# Altium project Template_W2022.PrjPcb
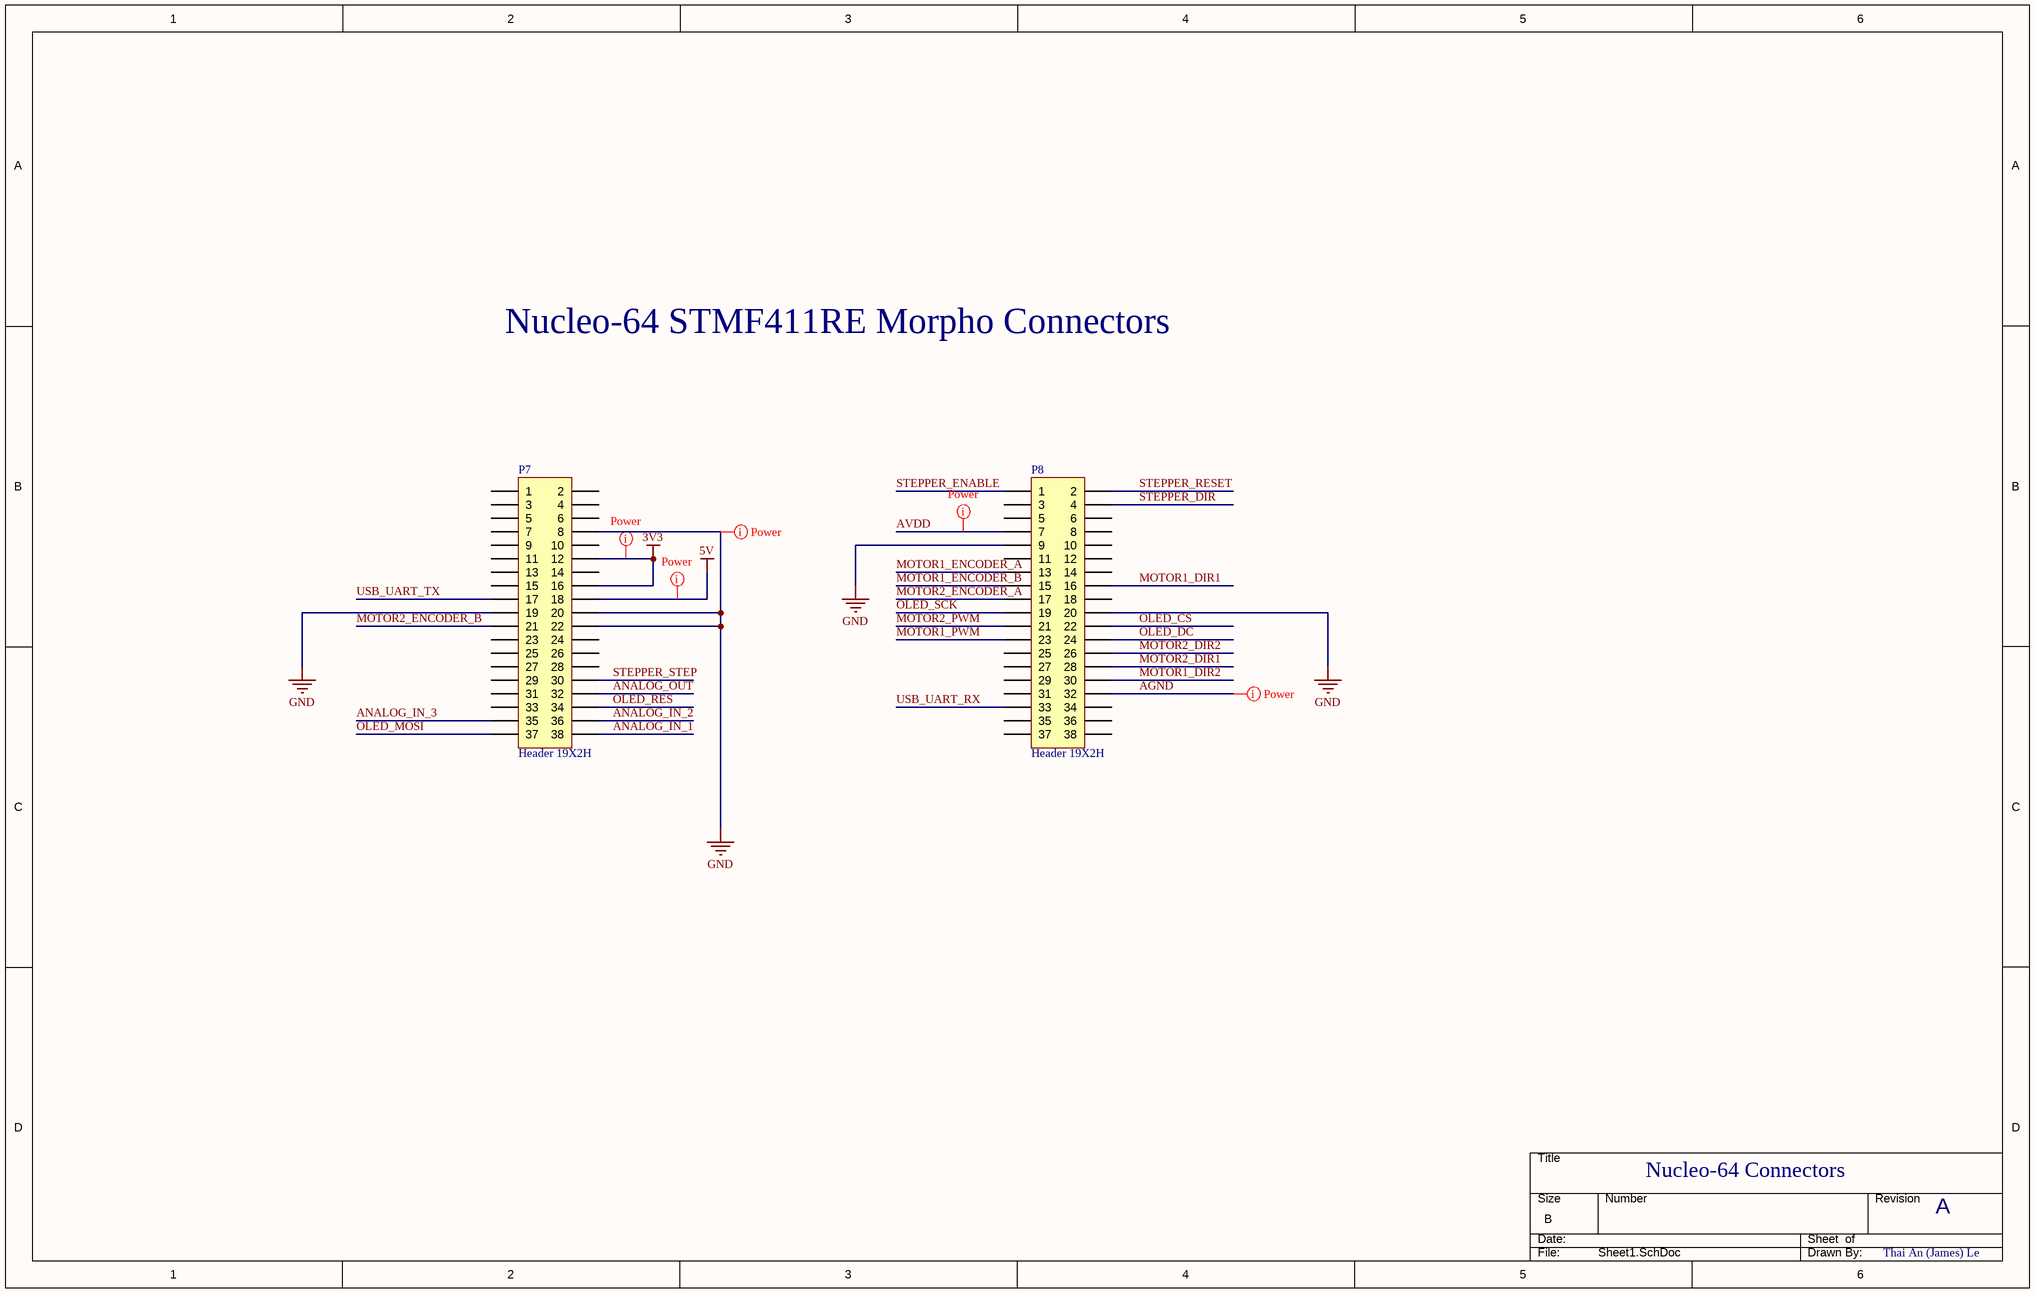
[diagram p0: Sheet1.SchDoc]
4 sheets, 35 parts. Net scope: global (net labels, ports and power ports of the same name join across sheets).
Board file: Template_F411.PcbDoc
Sheets:
  Sheet1.SchDoc
  Sheet2.SchDoc
  Sheet3.SchDoc
  Mechanical.SchDoc

## Sheet Sheet1.SchDoc: Nucleo-64 Connectors
size B; Revision: A

### Parts
P7  Header 19X2H  [PPPC192LFBN-RC]
P8  Header 19X2H  [PPPC192LFBN-RC]

### Nets
3V3: P7.12 P7.16
5V: P7.18
GND: P7.8 P7.19 P7.20 P7.22 P8.9 P8.20
AGND: P8.32
ANALOG_IN_1: P7.38
ANALOG_IN_2: P7.36
ANALOG_IN_3: P7.35
ANALOG_OUT: P7.32
AVDD: P8.7
MOTOR1_DIR1: P8.16
MOTOR1_DIR2: P8.30
MOTOR1_ENCODER_A: P8.13
MOTOR1_ENCODER_B: P8.15
MOTOR1_PWM: P8.23
MOTOR2_DIR1: P8.28
MOTOR2_DIR2: P8.26
MOTOR2_ENCODER_A: P8.17
MOTOR2_ENCODER_B: P7.21
MOTOR2_PWM: P8.21
OLED_CS: P8.22
OLED_DC: P8.24
OLED_MOSI: P7.37
OLED_RES: P7.34
OLED_SCK: P8.19
STEPPER_DIR: P8.4
STEPPER_ENABLE: P8.1
STEPPER_RESET: P8.2
STEPPER_STEP: P7.30
USB_UART_RX: P8.33
USB_UART_TX: P7.17

Not connected (* = marked no-connect by the designer): P7 1 2 3 4 5 6 7 9 10 11 13 14 15 23 24 25 26 27 28 29 31 33; P8 3 5 6 8 10 11 12 14 18 25 27 29 31 34 35 36 37 38

### Layout directives
net class POWER: 3V3, 5V, AGND, AVDD, GND

### Notes on the sheet
- Nucleo-64 STMF411RE Morpho Connectors
- Nucleo-64 Connectors
- A
- Thai An (James) Le
- DWG. NO.
- REV.
- SHT.
- THIS DOCUMENT AND THE DATA DISCLOSED HEREIN OR HEREWITH IS THE PROPERTY OF ALTIUM LIMITED AND MAY BE FREELY DISTRIBUTED IN WHOLE. NO RIGHTS ARE RESERVED OR EXPRESS OR IMPLIED WARANTEE GIVEN.
- REVISION
- DESCRIPTION
- DATE
- APPROVED
- ENG:
- APPROVALS
- PROJECT
- DSN:
- CHK:
- REFERENCE DOCUMENTS
- PROJECT REVISION:
- TITLE
- DOCUMENT REVISION:
- DESIGN ITEM:
- BOM:
- FAB DWG:
- PCB DWG:
- ASSY DWG:
- SCALE:
- SIZE
- B
- CAGE CODE
- FILE NAME
- DWG NO.
- SHEET
- OF
- REV

### Library data of the parts
P7 P8 = Header 19X2H: 38 Position Header Connector 0.100in (2.54mm) Through Hole Gold; PN: S7122-ND; URL: https://www.digikey.ca/product-detail/en/sullins-connector-solutions/PPPC192LFBN-RC/S7122-ND; MPN: PPPC192LFBN-RC

## Sheet Sheet2.SchDoc
size B; DrawnBy: Mike Jarabek; DocumentNumber: Template_W2022.PrjPcb
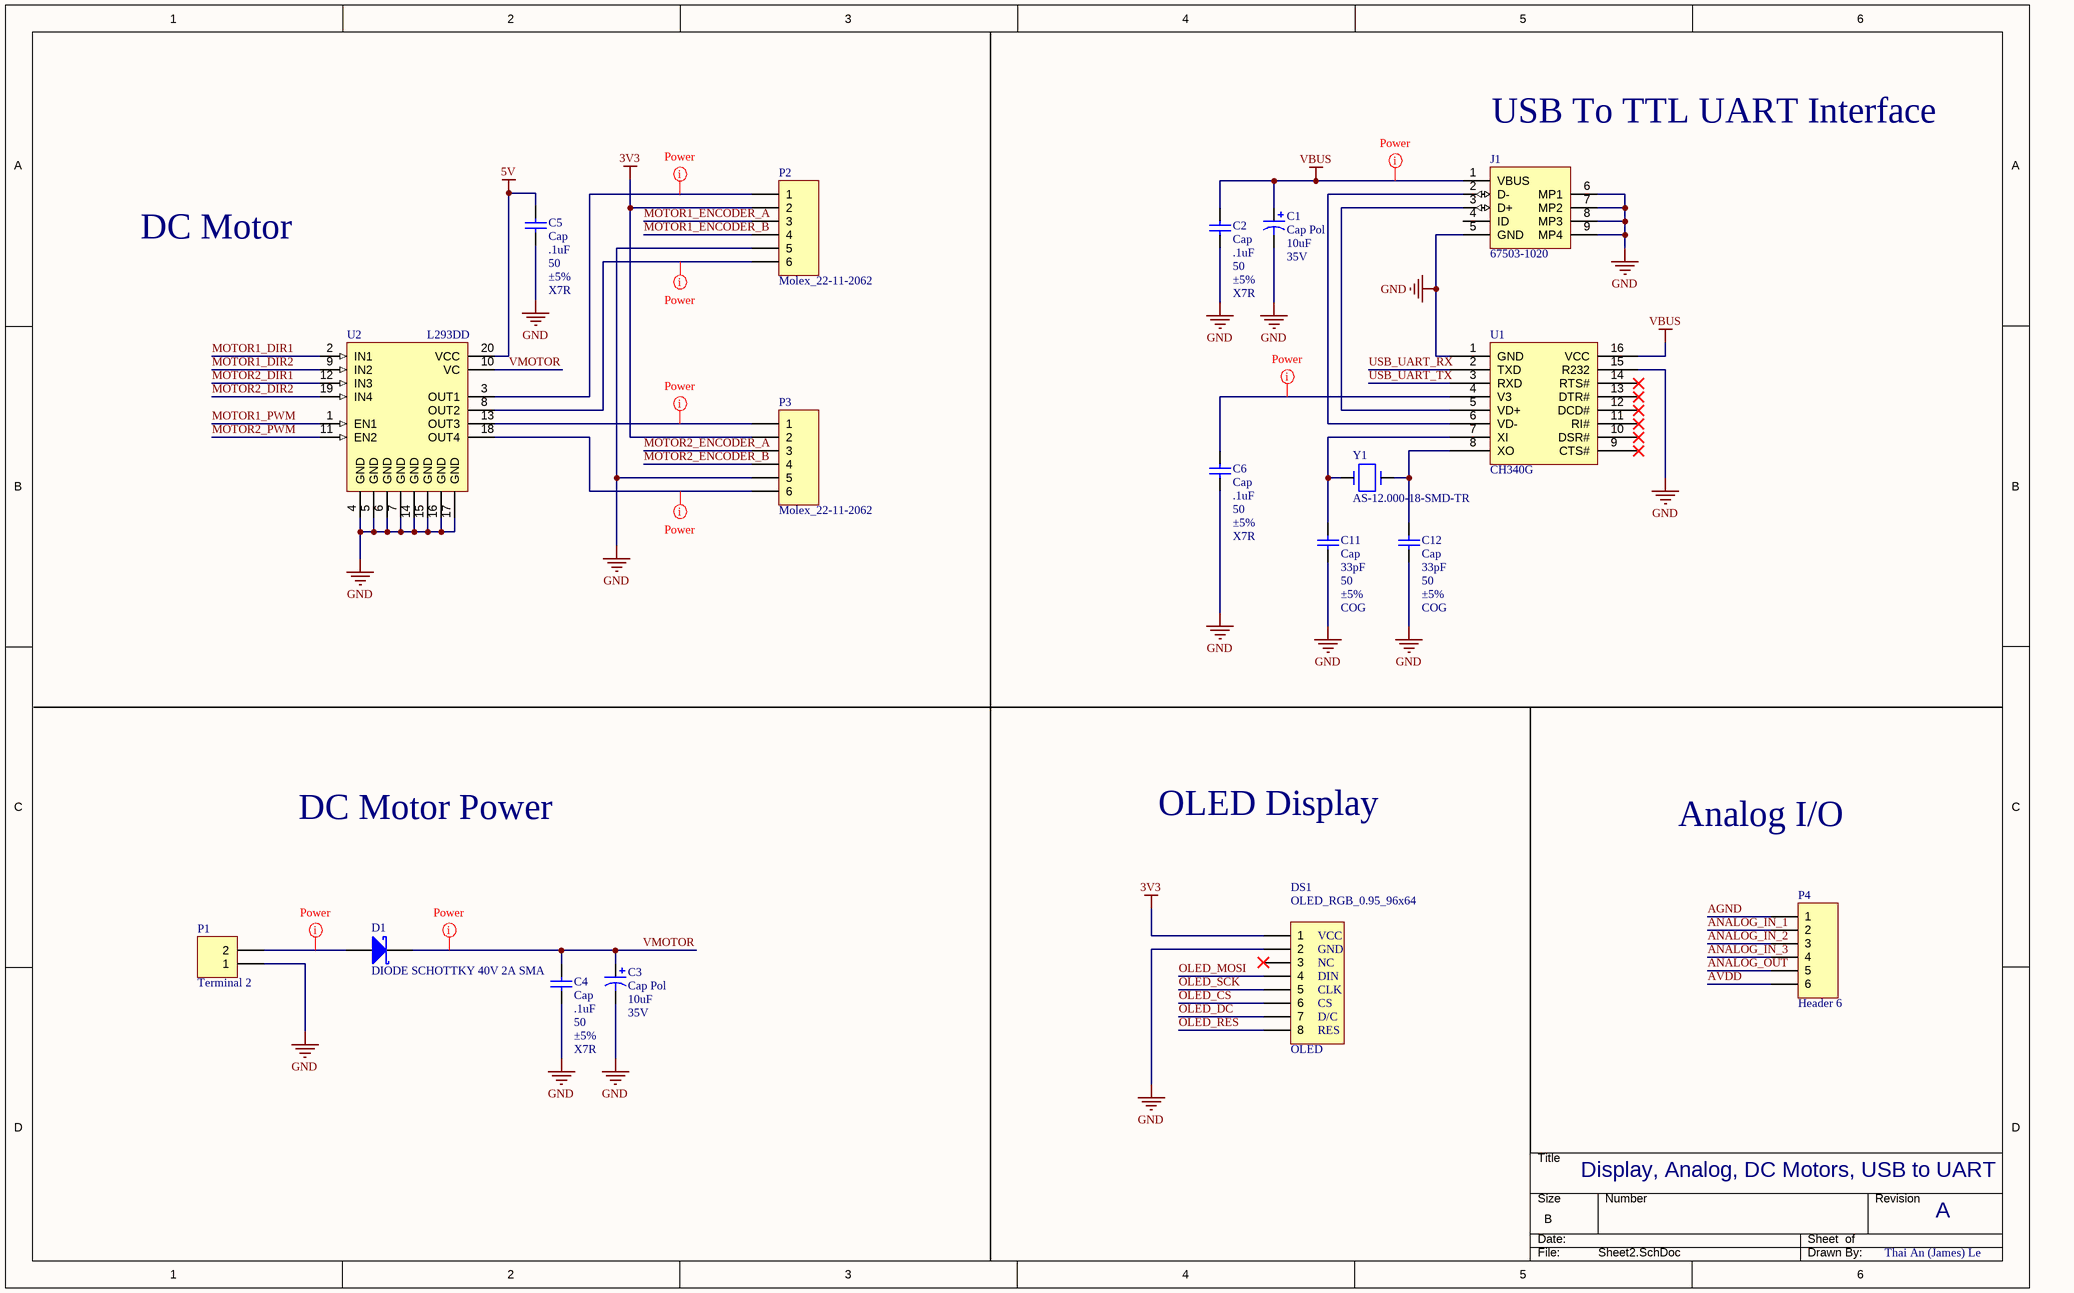
[diagram p1: Sheet2.SchDoc]

### Parts
C1  Cap Pol  value 10uF  Voltage: 35V  [CAPACITOR_5MM]
C2  Cap  value .1uF  WV: 50  Tolerance: ±5%  Type: X7R  [CAPC2012X09M]
C3  Cap Pol  value 10uF  Voltage: 35V  [CAPACITOR_5MM]
C4  Cap  value .1uF  WV: 50  Tolerance: ±5%  Type: X7R  [CAPC2012X09M]
C5  Cap  value .1uF  WV: 50  Tolerance: ±5%  Type: X7R  [CAPC2012X09M]
C6  Cap  value .1uF  WV: 50  Tolerance: ±5%  Type: X7R  [CAPC2012X09M]
C11  Cap  value 33pF  WV: 50  Tolerance: ±5%  Type: COG  [CAPC2012X09M]
C12  Cap  value 33pF  WV: 50  Tolerance: ±5%  Type: COG  [CAPC2012X09M]
D1  DIODE SCHOTTKY 40V 2A SMA  [DIOM4326X23M]
DS1  OLED  [OLED_RGB_0.95_96x64_Waveshare]
J1  67503-1020  [MOLX-67503-1020_V]
P1  Terminal 2  [TYCO_282841_2]
P2  Molex_22-11-2062  [MOLEX_22-11-2062]
P3  Molex_22-11-2062  [MOLEX_22-11-2062]
P4  Header 6  [HDR1X6]
U1  CH340G  [NSO16_L]
U2  L293DD  [SO20_N]
Y1  AS-12.000-18-SMD-TR  [HCS-49/U]

### Nets
3V3: DS1.1 P2.2 P3.2
5V: C5.2 U2.20(VCC)
GND: C1.2 C2.1 C3.2 C4.1 C5.1 C6.1 C11.1 C12.1 DS1.2 J1.5(GND) J1.6(MP1) J1.7(MP2) J1.8(MP3) J1.9(MP4) P1.1 P2.5 P3.5 U1.1(GND) U1.15(R232) U2.4(GND) U2.5(GND) U2.6(GND) U2.7(GND) U2.14(GND) U2.15(GND) U2.16(GND) U2.17(GND)
VBUS: C1.1 C2.2 J1.1(VBUS) U1.16(VCC)
AGND: P4.1
ANALOG_IN_1: P4.2
ANALOG_IN_2: P4.3
ANALOG_IN_3: P4.4
ANALOG_OUT: P4.5
AVDD: P4.6
MOTOR1_DIR1: U2.2(IN1)
MOTOR1_DIR2: U2.9(IN2)
MOTOR1_ENCODER_A: P2.3
MOTOR1_ENCODER_B: P2.4
MOTOR1_PWM: U2.1(EN1)
MOTOR2_DIR1: U2.12(IN3)
MOTOR2_DIR2: U2.19(IN4)
MOTOR2_ENCODER_A: P3.3
MOTOR2_ENCODER_B: P3.4
MOTOR2_PWM: U2.11(EN2)
OLED_CS: DS1.6
OLED_DC: DS1.7
OLED_MOSI: DS1.4
OLED_RES: DS1.8
OLED_SCK: DS1.5
USB_UART_RX: U1.2(TXD)
USB_UART_TX: U1.3(RXD)
VMOTOR: C3.1 C4.2 D1.1(K) U2.10(VC)
NetC6_2: C6.2 U1.4(V3)
NetC11_2: C11.2 U1.7(XI) Y1.1
NetC12_2: C12.2 U1.8(XO) Y1.2
NetD1_2: D1.2(A) P1.2
NetJ1_2: J1.2(D-) U1.6(VD-)
NetJ1_3: J1.3(D+) U1.5(VD+)
NetP2_1: P2.1 U2.3(OUT1)
NetP2_6: P2.6 U2.8(OUT2)
NetP3_1: P3.1 U2.13(OUT3)
NetP3_6: P3.6 U2.18(OUT4)

Not connected (* = marked no-connect by the designer): DS1 3*; J1 4(ID); U1 9(CTS#)* 10(DSR#)* 11(RI#)* 12(DCD#)* 13(DTR#)* 14(RTS#)*

### Layout directives
net class POWER: NetC6_2, NetD1_2, NetP2_1, NetP2_6, NetP3_1, NetP3_6, VBUS, VMOTOR

### Notes on the sheet
- (near J1) USB To TTL UART Interface
- DC Motor
- DC Motor Power
- OLED Display
- Analog I/O
- Display, Analog, DC Motors, USB to UART
- A
- Thai An (James) Le
- (in symbol OLED_RGB_0.95_96x64_Waveshare) OLED_RGB_0.95_96x64; VCC; GND; NC; DIN; CLK; CS; D/C; RES

### Library data of the parts
C1 C3 = Cap Polar-10uF-35V: CAP 85C 10uF ±20% 35V WX Series Aluminum Electrolytic; MPN: UWX1V100MCL1GB; Tan Theta: 0.12; Leakage Current: 3.5; Rated Ripple Current: 29; PN: 493-2117-1-ND; Name: Cap Polar-10uF-35V; Diameter: 5; URL: http://www.digikey.ca/product-detail/en/UWX1V100MCL1GB/493-2117-1-ND
C2 C4-C6 = CAP-X7R-.1uF-50V-±5%: CAP CER .1uF 50v X7R 0805; MPN: C0805C104J5RACTU; PN: 399-1171-1-ND; Name: CAP-X7R-.1uF-50V-±5%; URL: http://www.digikey.ca/product-detail/en/C0805C104J5RACTU/399-1171-1-ND
C11 C12 = CAP-COG-33pF-50V-±5%: CAP CER 33pF 50v COG 0805; MPN: C0805C330J5GACTU; PN: 399-1115-1-ND; Name: CAP-COG-33pF-50V-±5%; URL: http://www.digikey.ca/product-detail/en/C0805C330J5GACTU/399-1115-1-ND
D1 = DIODE SCHOTTKY 40V 2A SMA: Schottky Rectifier; MPN: B240A-13-F; PN: B240A-FDICT-ND; URL: http://www.digikey.ca/product-detail/en/B240A-13-F/B240A-FDICT-ND
DS1 = OLED_RGB_0.95_96x64_Waveshare: Waveshare 0.95 inch OLED Module; MPN: PPPC081LFBN-RC; PN: S7041-ND; URL: https://www.digikey.ca/en/products/detail/sullins-connector-solutions/PPPC081LFBN-RC/810180
J1 = MOLX-67503-1020: USB, MINI, SMD, RA KME04-USBMU03A01; Manufacturer: Molex; ComponentLink1URL: http://www.molex.com/; PartNumber: 67503-1020; Mounting Technology: Surface Mount; ComponentLink1Description: Manufacturer URL; Terminal Pitch: 0.8 mm; DatasheetVersion: Rev F, 06/2009; ComponentLink2Description: Datasheet; PackageDescription: Mini USB Connector, SMT, Righer Angle; ComponentLink2URL: http://www.molex.com/pdm_docs/sd/675031020_sd.pdf; PackageReference: 67503-1020
P1 = Terminal 2: Terminal, 2-Pin; MPN: 282841-2; PN: A98342-ND; LatestRevisionDate: 17-Jul-2002; LatestRevisionNote: Re-released for DXP Platform.; Publisher: Altium Limited; URL: http://www.digikey.ca/product-detail/en/282841-2/A98342-ND/1136740
P2 P3 = Molex_22-11-2062: CONN HEADER 6POS .100 VERT GOLD; MPN: 0022112062; PN: WM2704-ND; URL: http://www.digikey.ca/product-detail/en/0022112062/WM2704-ND
P4 = Header 6: Header, 6-Pin Male; MPN: PEC06SFAN; PN: S1212E-06-ND; URL: http://www.digikey.ca/product-detail/en/PEC06SFAN/S1212E-06-ND
U1 = CH340G: USB to serial chip; PN: CH340G; MPN: CH340G; URL: https://www.mpja.com/download/35227cpdata.pdf
U2 = L293DD: IC MOTOR DRIVER PAR 20-SOIC; MPN: L293DD013TR; PN: 497-2937-1-ND; Published: 8-Jun-2000; LatestRevisionDate: 13-Apr-2006; LatestRevisionNote: IPC-7351 Footprint Added.; DatasheetVersion: Jun-1996; PackageVersion: Jul-2001; PackageReference: SO20; Publisher: Altium Limited; PackageDescription: 20-Pin Plastic Small Outline Integrated Circuit 1.27 mm Pitch; Code_JEDEC: MS-013-AC; Code_IPC: SOIC127P1030-20; ComponentLink1Description: Manufacturer Link; ComponentLink1URL: http://www.st.com/; ComponentLink2Description: Datasheet; ComponentLink2URL: http://www.st.com/stonline/products/literature/ds/1330/l293d.pdf; URL: http://www.digikey.ca/product-detail/en/L293DD013TR/497-2937-1-ND
Y1 = AS-12.000-18-SMD-TR: CRYSTAL 12.0000MHZ 18PF SMD; PN: 2151-AS-12.000-18-SMD-TRCT-ND; URL: https://www.digikey.ca/en/products/detail/raltron-electronics/AS-12-000-18-SMD-TR/10271753; MPN: AS-12.000-18-SMD-TR

## Sheet Sheet3.SchDoc
size B
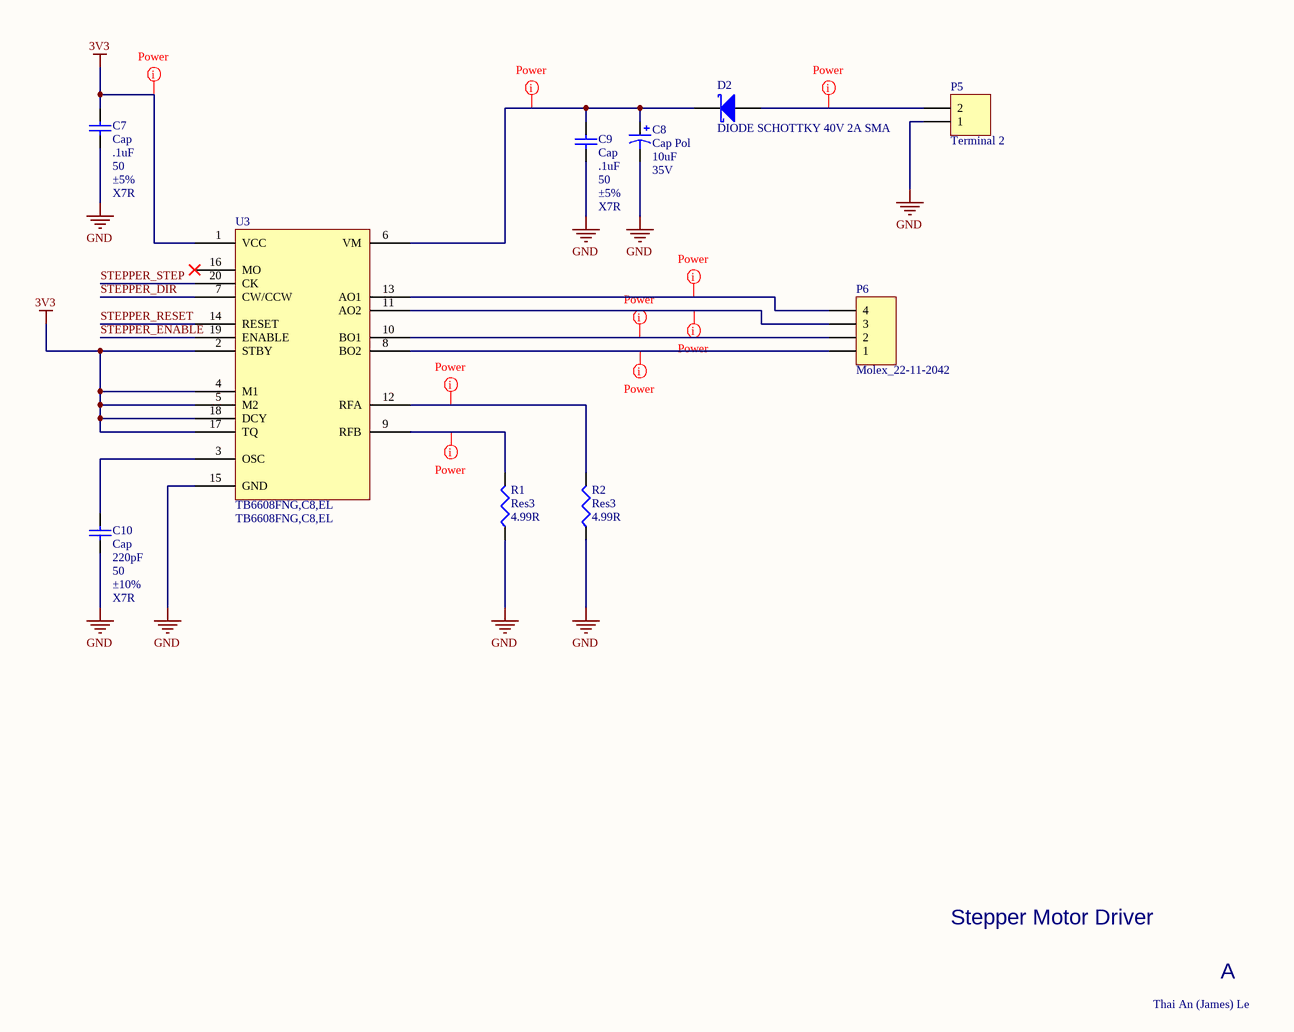
[diagram p2: Sheet3.SchDoc]

### Parts
C7  Cap  value .1uF  WV: 50  Tolerance: ±5%  Type: X7R  [CAPC2012X09M]
C8  Cap Pol  value 10uF  Voltage: 35V  [CAPACITOR_5MM]
C9  Cap  value .1uF  WV: 50  Tolerance: ±5%  Type: X7R  [CAPC2012X09M]
C10  Cap  value 220pF  WV: 50  Tolerance: ±10%  Type: X7R  [CAPC2012X09M]
D2  DIODE SCHOTTKY 40V 2A SMA  [DIOM4326X23M]
P5  Terminal 2  [TYCO_282841_2]
P6  Molex_22-11-2042  [MOLEX-22-11-2042]
R1  Res3  value 4.99R  [RESC2112X05M]
R2  Res3  value 4.99R  [RESC2112X05M]
U3  TB6608FNG,C8,EL  [TSOP65P640X160-20M]

### Nets
3V3: C7.2 U3.1(VCC) U3.2(STBY) U3.4(M1) U3.5(M2) U3.17(TQ) U3.18(DCY)
GND: C7.1 C8.2 C9.1 C10.1 P5.1 R1.1 R2.1 U3.15(GND)
STEPPER_DIR: U3.7(CW/CCW)
STEPPER_ENABLE: U3.19(ENABLE)
STEPPER_RESET: U3.14(RESET)
STEPPER_STEP: U3.20(CK)
NetC8_1: C8.1 C9.2 D2.1(K) U3.6(VM)
NetC10_2: C10.2 U3.3(OSC)
NetD2_2: D2.2(A) P5.2
NetP6_1: P6.1 U3.8(BO2)
NetP6_2: P6.2 U3.10(BO1)
NetP6_3: P6.3 U3.11(AO2)
NetP6_4: P6.4 U3.13(AO1)
NetR1_2: R1.2 U3.9(RFB)
NetR2_2: R2.2 U3.12(RFA)

Not connected (* = marked no-connect by the designer): U3 16(MO)*

### Layout directives
net class POWER: 3V3, NetC8_1, NetD2_2, NetP6_1, NetP6_2, NetP6_3, NetP6_4, NetR1_2, NetR2_2

### Notes on the sheet
- Stepper Motor Driver
- A
- Thai An (James) Le

### Library data of the parts
C7 C9 = CAP-X7R-.1uF-50V-±5%: as C2 on sheet Sheet2; Name: CAP-X7R-.1uF-50V-±5%; URL: http://www.digikey.ca/product-detail/en/C0805C104J5RACTU/399-1171-1-ND
C8 = Cap Polar-10uF-35V: as C1 on sheet Sheet2; Name: Cap Polar-10uF-35V; Diameter: 5; URL: http://www.digikey.ca/product-detail/en/UWX1V100MCL1GB/493-2117-1-ND
C10 = CAP-X7R-220pF-50V-±10%: CAP CER 220pF 50v X7R 0805; MPN: C0805C221K5RACTU; PN: 399-1138-1-ND; Name: CAP-X7R-220pF-50V-±10%; URL: http://www.digikey.ca/product-detail/en/C0805C221K5RACTU/399-1138-1-ND
D2 = DIODE SCHOTTKY 40V 2A SMA: as D1 on sheet Sheet2; URL: http://www.digikey.ca/product-detail/en/B240A-13-F/B240A-FDICT-ND
P5 = Terminal 2: as P1 on sheet Sheet2; LatestRevisionDate: 17-Jul-2002; LatestRevisionNote: Re-released for DXP Platform.; Publisher: Altium Limited; URL: http://www.digikey.ca/product-detail/en/282841-2/A98342-ND/1136740
P6 = Molex_22-11-2042: CONN HEADER 4POS .100 VERT GOLD; MPN: 0022112042; PN: WM2702-ND; URL: http://www.digikey.ca/product-detail/en/0022112042/WM2702-ND
R1 R2 = Resistor_4.99R: RES SMD 4.99R OHM 1% 1/8W 0805; MPN: CRCW08054R99FKEA; PN: 541-4.99CCCT-ND; Name: Resistor_4.99R; URL: http://www.digikey.ca/product-detail/en/CRCW08054R99FKEA/541-4.99CCCT-ND
U3 = TB6608FNG,C8,EL: IC MTR DRV BIPLR 2.7-5.5V 20SSOP; PN: TB6608FNGC8ELCT-ND; URL: https://www.digikey.ca/en/products/detail/toshiba-semiconductor-and-storage/TB6608FNG-C8-EL/1730074; MPN: TB6608FNG,C8,EL

## Sheet Mechanical.SchDoc
size A4
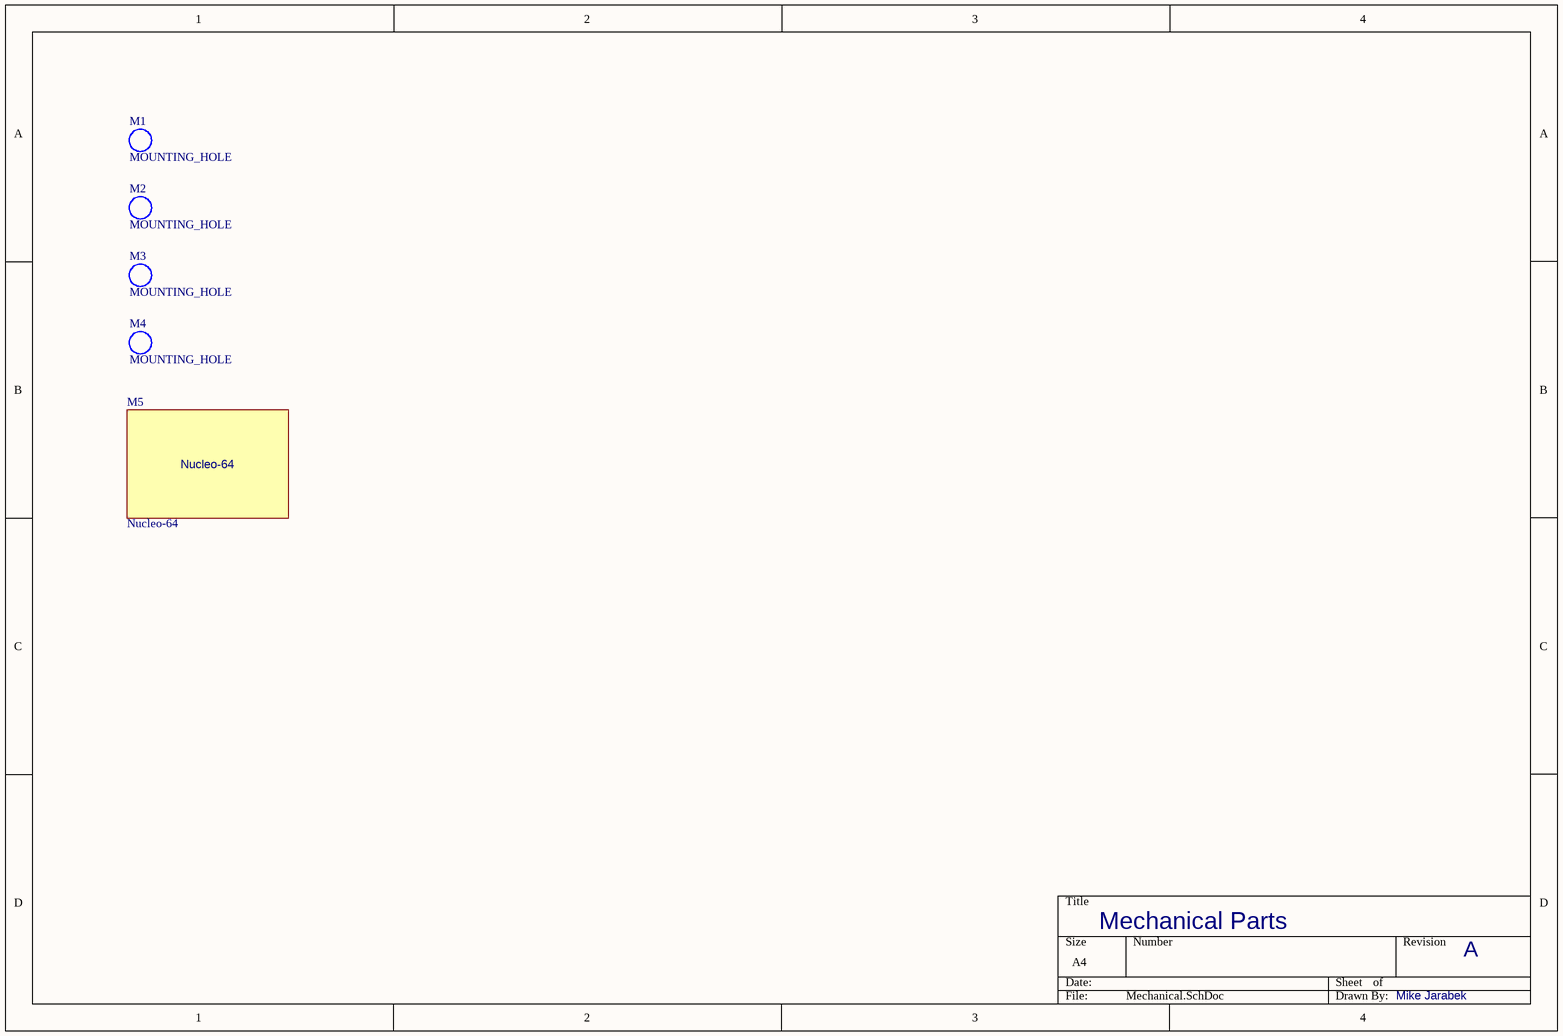
[diagram p3: Mechanical.SchDoc]

### Parts
M1  MOUNTING_HOLE  [MOUNTING_HOLE]
M2  MOUNTING_HOLE  [MOUNTING_HOLE]
M3  MOUNTING_HOLE  [MOUNTING_HOLE]
M4  MOUNTING_HOLE  [MOUNTING_HOLE]
M5  Nucleo-64  [NUCLEO_64]

### Notes on the sheet
- Mechanical Parts
- A
- Mike Jarabek

### Library data of the parts
M1-M4 = MOUNTING_HOLE: Mounting Hole
M5 = Nucleo-64: Nucleo-64 Board Model

## Nets that join several sheets
3V3: Sheet1 (P7.12 P7.16), Sheet2 (DS1.1 P2.2 P3.2), Sheet3 (7 pins)
5V: Sheet1 (P7.18), Sheet2 (C5.2 U2.20)
GND: Sheet1 (6 pins), Sheet2 (27 pins), Sheet3 (8 pins)
AGND: Sheet1 (P8.32), Sheet2 (P4.1)
ANALOG_IN_1: Sheet1 (P7.38), Sheet2 (P4.2)
ANALOG_IN_2: Sheet1 (P7.36), Sheet2 (P4.3)
ANALOG_IN_3: Sheet1 (P7.35), Sheet2 (P4.4)
ANALOG_OUT: Sheet1 (P7.32), Sheet2 (P4.5)
AVDD: Sheet1 (P8.7), Sheet2 (P4.6)
MOTOR1_DIR1: Sheet1 (P8.16), Sheet2 (U2.2)
MOTOR1_DIR2: Sheet1 (P8.30), Sheet2 (U2.9)
MOTOR1_ENCODER_A: Sheet1 (P8.13), Sheet2 (P2.3)
MOTOR1_ENCODER_B: Sheet1 (P8.15), Sheet2 (P2.4)
MOTOR1_PWM: Sheet1 (P8.23), Sheet2 (U2.1)
MOTOR2_DIR1: Sheet1 (P8.28), Sheet2 (U2.12)
MOTOR2_DIR2: Sheet1 (P8.26), Sheet2 (U2.19)
MOTOR2_ENCODER_A: Sheet1 (P8.17), Sheet2 (P3.3)
MOTOR2_ENCODER_B: Sheet1 (P7.21), Sheet2 (P3.4)
MOTOR2_PWM: Sheet1 (P8.21), Sheet2 (U2.11)
OLED_CS: Sheet1 (P8.22), Sheet2 (DS1.6)
OLED_DC: Sheet1 (P8.24), Sheet2 (DS1.7)
OLED_MOSI: Sheet1 (P7.37), Sheet2 (DS1.4)
OLED_RES: Sheet1 (P7.34), Sheet2 (DS1.8)
OLED_SCK: Sheet1 (P8.19), Sheet2 (DS1.5)
STEPPER_DIR: Sheet1 (P8.4), Sheet3 (U3.7)
STEPPER_ENABLE: Sheet1 (P8.1), Sheet3 (U3.19)
STEPPER_RESET: Sheet1 (P8.2), Sheet3 (U3.14)
STEPPER_STEP: Sheet1 (P7.30), Sheet3 (U3.20)
USB_UART_RX: Sheet1 (P8.33), Sheet2 (U1.2)
USB_UART_TX: Sheet1 (P7.17), Sheet2 (U1.3)